# EAGLE design WNG_1_0 (EAGLE 7.6.0)
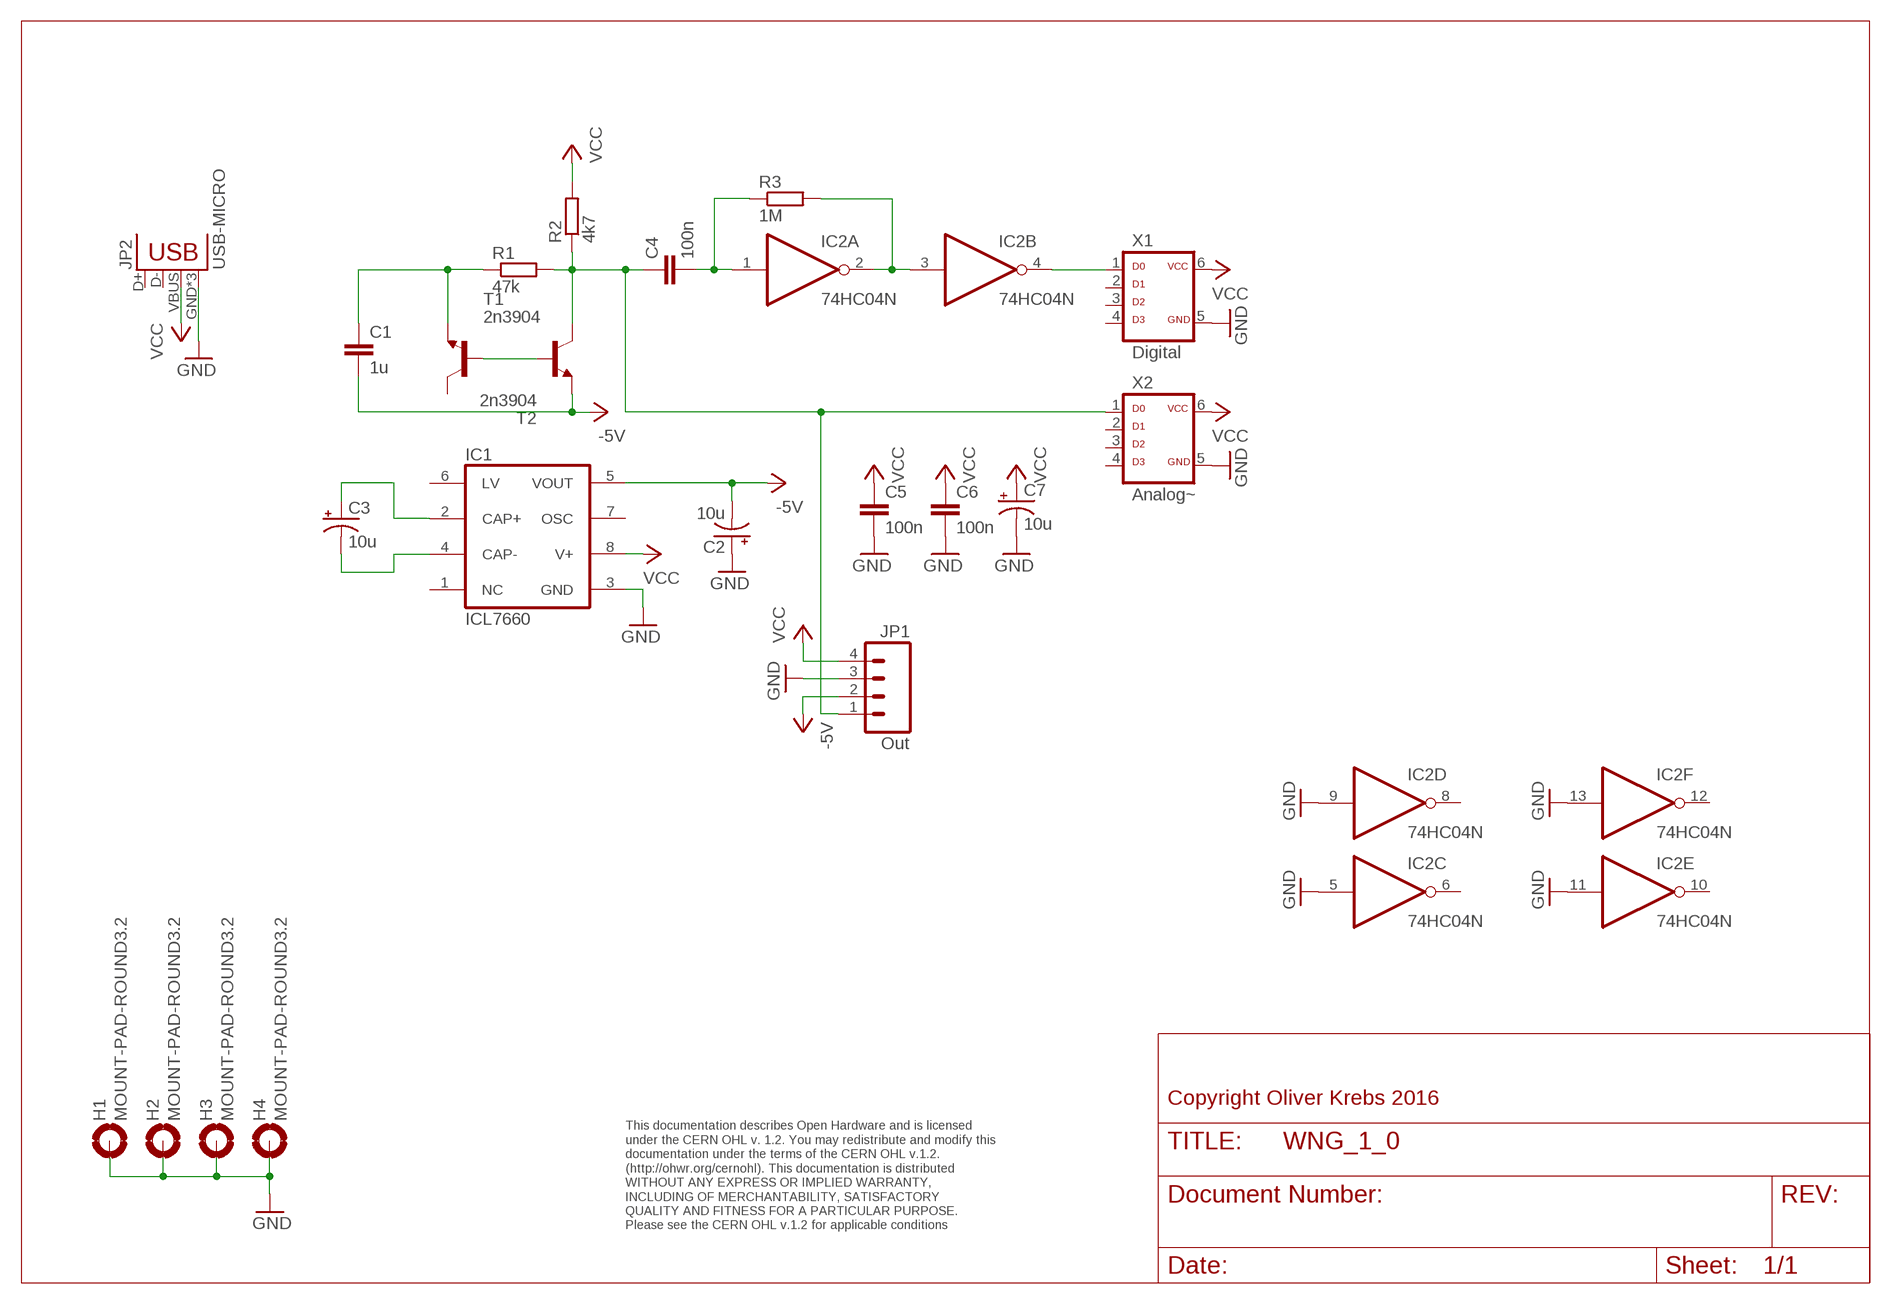
[diagram p0: schematic, sheet 1]

## Parts
C1  1u  CAPPTH1  [CAP-PTH-5MM]
C2  10u  CAP_POLPTH2  [CPOL-RADIAL-10UF-25V]
C3  10u  CAP_POLPTH2  [CPOL-RADIAL-10UF-25V]
C4  100n  CAPPTH1  [CAP-PTH-5MM]
C5  100n  CAPPTH1  [CAP-PTH-5MM]
C6  100n  CAPPTH1  [CAP-PTH-5MM]
C7  10u  CAP_POLPTH2  [CPOL-RADIAL-10UF-25V]
H1  MOUNT-PAD-ROUND3.2  [3,2-PAD]
H2  MOUNT-PAD-ROUND3.2  [3,2-PAD]
H3  MOUNT-PAD-ROUND3.2  [3,2-PAD]
H4  MOUNT-PAD-ROUND3.2  [3,2-PAD]
IC1  ICL7660  ICL7660CPA  [DIL08]
IC2  74HC04N  [DIL14]
JP1  Out  M04PTH  [1X04]
JP2  USB-MICRO  USB-MICROB2  [USB-MICROB2]
R1  47k  R-EU_0207/10  [0207/10]
R2  4k7  R-EU_0207/10  [0207/10]
R3  1M  R-EU_0207/10  [0207/10]
T1  2n3904  2N3904-NPN-TO92-EBC  [TO92-EBC]
T2  2n3904  2N3904-NPN-TO92-EBC  [TO92-EBC]
X1  Digital  ML6D  [ML-6]
X2  Analog~  ML6D  [ML-6]

## Nets
-5V: C1.2 C2.2(-) IC1.5(VOUT) JP1.2 T1.E
GND: C2.1(+) C5.2 C6.2 C7.2(-) H1.B3,2(MOUNT) H2.B3,2(MOUNT) H3.B3,2(MOUNT) H4.B3,2(MOUNT) IC1.3(GND) IC2.5(C:I) IC2.9(D:I) IC2.11(E:I) IC2.13(F:I) JP1.3 JP2.GND JP2.MT1(GND) JP2.MT2(GND) X1.5 X2.5
N$1: C1.1 R1.1 T2.E
N$2: C4.2 IC2.1(A:I) R3.1
N$3: C4.1 JP1.1 R1.2 R2.1 T1.C X2.1
N$4: T1.B T2.B
N$5: C3.1(+) IC1.2(CAP+)
N$6: C3.2(-) IC1.4(CAP-)
N$7: IC2.2(A:O) IC2.3(B:I) R3.2
N$11: IC2.4(B:O) X1.1
VCC: C5.1 C6.1 C7.1(+) IC1.8(V+) JP1.4 JP2.VBUS R2.2 X1.6 X2.6
Unconnected: IC1.1(NC) IC1.6(LV) IC1.7(OSC) IC2.6(C:O) IC2.8(D:O) IC2.10(E:O) IC2.12(F:O) JP2.D+ JP2.D- T2.C X1.2 X1.3 X1.4 X2.2 X2.3 X2.4

## Notes on the sheet
- Copyright Oliver Krebs 2016
- This documentation describes Open Hardware and is licensed 
  under the CERN OHL v. 1.2. You may redistribute and modify this 
  documentation under the terms of the CERN OHL v.1.2. 
  (http://ohwr.org/cernohl). This documentation is distributed
  WITHOUT ANY EXPRESS OR IMPLIED WARRANTY, 
  INCLUDING OF MERCHANTABILITY, SATISFACTORY 
  QUALITY AND FITNESS FOR A PARTICULAR PURPOSE. 
  Please see the CERN OHL v.1.2 for applicable conditions

## Power pins joined to a net without a drawn wire
GND: IC2.7(P:GND)
VCC: IC2.14(P:VCC)

## Library data of the parts
C1 C4-C6 = SparkFun-Passives:CAP: Capacitor Standard 0603 ceramic capacitor, and 0.1" leaded capacitor.
C2 C3 C7 = SparkFun-Passives:CAP_POL: Capacitor Polarized These are standard SMD and PTH capacitors. Normally 10uF, 47uF, and 100uF in electrolytic and tantalum varieties. Always verify the external diameter of the through hole cap, it varies with capacity, voltage, and manufacturer. The EIA devices should be standard.
H1-H4 = holes:MOUNT-PAD-ROUND: MOUNTING PAD, round
IC1 = maxim:ICL7660CPA: VOLTAGE CONVERTER; MF: INTERSIL; MPN: ICL7660CPA; OC_FARNELL: 1018170; OC_NEWARK: 06F7441
IC2 = 74xx-eu:74*04: Hex INVERTER
JP1 = SparkFun-Connectors:M04: Header 4 Standard 4-pin 0.1" header. Use with straight break away headers (SKU : PRT-00116), right angle break away headers (PRT-00553), swiss pins (PRT-00743), machine pins (PRT-00117), and female headers (PRT-00115). Molex polarized connector foot print use with SKU : PRT-08231 with associated crimp pins and housings. 1MM SMD Version SKU: PRT-10208
JP2 = SparkFun-Connectors:USB: USB Connectors USB-B-PTH is fully proven SKU : PRT-00139/CONN-08278 USB-miniB is fully proven SKU : PRT-00587 USB-A-PCB is untested. USB-A-H is throughly reviewed, but untested. Spark Fun Electronics SKU : PRT-00437 USB-B-SMT is throughly reviewed, but untested. Needs silkscreen touching up. USB-A-S has not been used/tested USB-MB-H has not been used/tested USB-MICROB has been used. CONN-09505
R1-R3 = 01-my_rcl:R-EU_: RESISTOR, European symbol
T1 T2 = transistor-neu-to92:*-NPN-: NPN Transistror
X1 X2 = 01-my-con:ML6D

## Board
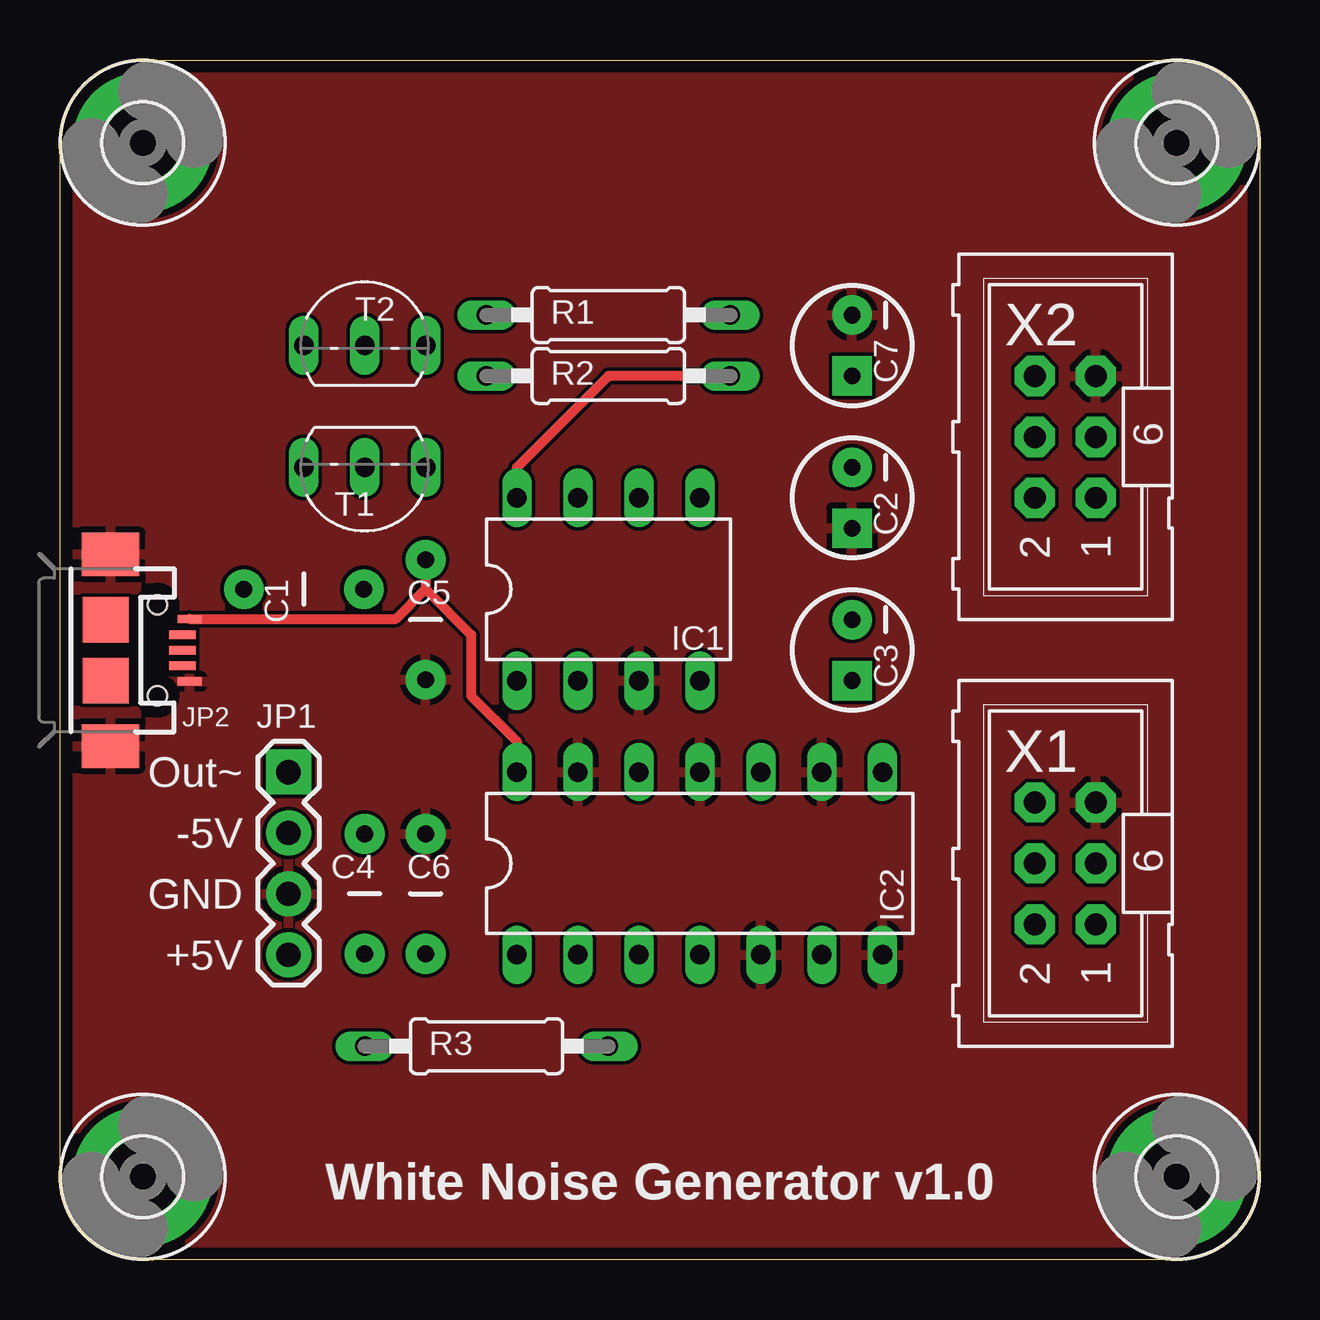
[diagram p1: board, top side]
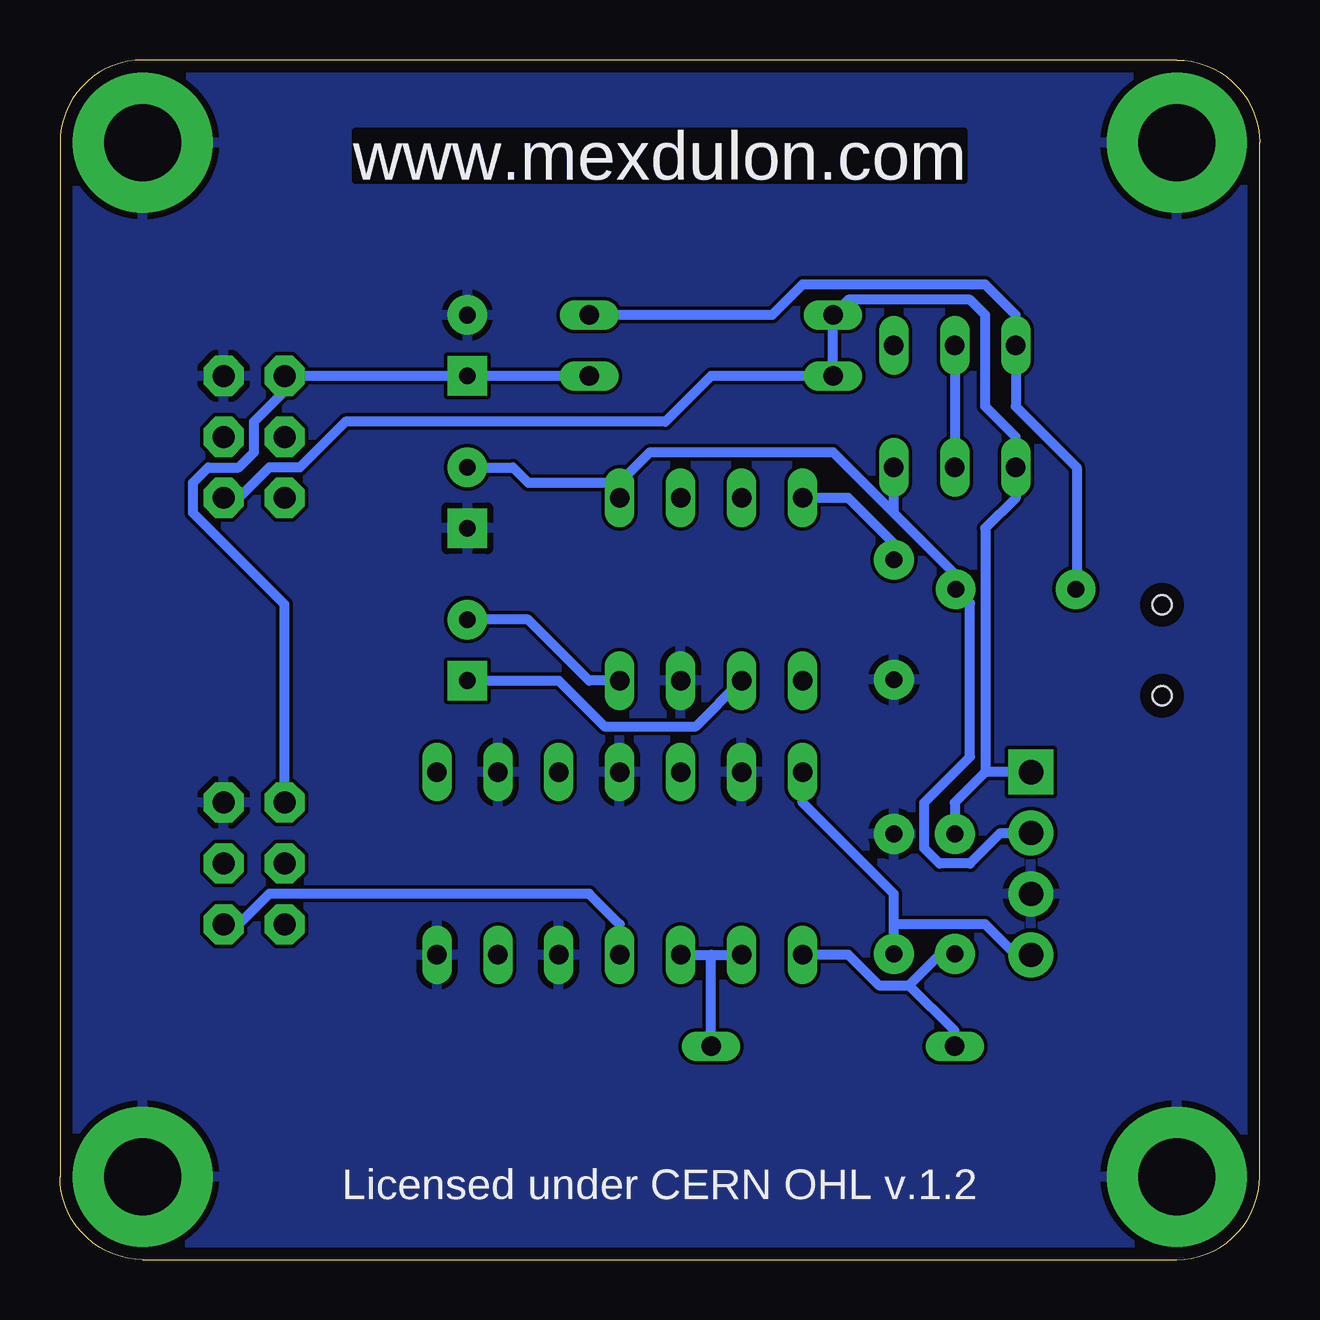
[diagram p2: board, bottom side, seen from below]

Size 50 x 50 mm. Coordinates in mm from the lower left corner, seen from the top.
Outline: 0,3.45 0,46.55 arc-90 3.45,50 46.55,50 arc-90 50,46.55 50,3.45 arc-90 46.55,0 3.45,0 arc-90 0,3.45
Copper layers (1*16): Top 0.035mm / dielectric 1.6mm / Bottom 0.035mm
Design rules "Elecrow_2-layer_PCB_eagle_rule": minimum track width 6mil, minimum drill 12mil, track to track 6mil, track to pad 6mil, pad to pad 6mil, via to via 8mil, smd to smd 0mil, copper to edge 20mil, drill to drill 10mil, minimum pad ring 6mil, minimum via ring 6mil, stop-mask expansion 0mil, vias tented up to drill 100mil, thermal gap 10mil

### Footprints (pad centres in the part's own frame; a part is rotated, then mirrored left to right if it is on the bottom)
CAP-PTH-5MM = drill 0.7 pad 1.651: 1 -2.5,0; 2 2.5,0
CPOL-RADIAL-10UF-25V = drill 0.7 pad 1.651 square: 1 1.27,0 | drill 0.7 pad 1.651: 2 -1.27,0
3,2-PAD = drill 3.2 pad 5.842: B3,2 0,0
DIL08 = drill 0.813 long: 1 -3.81,-3.81; 2 -1.27,-3.81; 3 1.27,-3.81; 4 3.81,-3.81; 5 3.81,3.81; 6 1.27,3.81; 7 -1.27,3.81; 8 -3.81,3.81
DIL14 = drill 0.813 long: 1 -7.62,-3.81; 2 -5.08,-3.81; 3 -2.54,-3.81; 4 0,-3.81; 5 2.54,-3.81; 6 5.08,-3.81; 7 7.62,-3.81; 8 7.62,3.81; 9 5.08,3.81; 10 2.54,3.81; 11 0,3.81; 12 -2.54,3.81; 13 -5.08,3.81; 14 -7.62,3.81
1X04 = drill 1.016 pad 1.88 square: 1 0,0 | drill 1.016 pad 1.88: 2 2.54,0; 3 5.08,0; 4 7.62,0
USB-MICROB2 = smd 0.35 x 1.1: D+ 0,3.2; D- -0.65,3.2; ID 0.65,3.2 | smd 0.35 x 1: GND 1.3,3.5; VBUS -1.3,3.5 | smd 1.8 x 2.4: MT1 -4,0.2; MT2 4,0.2 | smd 1.9 x 1.9: P$1 -1.27,0; P$2 1.27,0 | hole 0.8: -1.9,2.15; 1.9,2.15
0207/10 = drill 0.813 long: 1 -5.08,0; 2 5.08,0
TO92-EBC = drill 0.813 long: B 0,-1.27; C 2.54,-1.27; E -2.54,-1.27
ML-6 = drill 0.914 pad 1.676 octagon: 1 -2.54,-1.27; 2 -2.54,1.27; 3 0,-1.27; 4 0,1.27; 5 2.54,-1.27; 6 2.54,1.27

### Placement (x,y rotation side)
C1  10.16,27.94 0 top
C2  33.02,31.75 270 top
C3  33.02,25.4 270 top
C4  12.7,15.24 270 top
C5  15.24,26.67 270 top
C6  15.24,15.24 90 top
C7  33.02,38.1 270 top
H1  3.45,3.45 0 top
H2  3.45,46.55 0 top
H3  46.55,3.45 0 top
H4  46.55,46.55 0 top
IC1  22.86,27.94 0 top
IC2  26.67,16.51 0 top
JP1  9.53,20.32 270 top
JP2  1.91,25.4 270 top
R1  22.86,39.37 180 top
R2  22.86,36.83 0 top
R3  17.78,8.89 0 top
T1  12.7,31.75 180 top
T2  12.7,39.37 0 top
X1  41.91,16.51 90 top
X2  41.91,34.29 90 top

### Tracks (layer width: path | path; a pad name or v marks a point on that pad's centre or on a via)
-5V
  Bottom 0.406: 26.67,32.38 IC1.5 | 15.24,31.11 12.7,28.57 C1.2 12.06,27.34 12.06,20.95 13.97,19.05 13.97,17.14 13.34,16.51 12.06,16.51 10.79,17.78 JP1.2 | 15.24,31.11 T1.E | 15.24,31.11 17.78,33.66 25.4,33.66 26.67,32.38 | C2.2 31.11,33.02 30.48,32.38 26.67,32.38
GND
  pour Bottom: 0,0 50.8,0 50.8,50.8 0,50.8
  pour Top: 0,50.16 50.16,50.16 50.16,0 0,0
N$1
  Bottom 0.406: R1.1 20.32,39.37 19.05,40.64 11.43,40.64 10.16,39.37 T2.E 10.16,35.56 7.62,33.02 7.62,27.98 C1.1
N$2
  Bottom 0.406: 14.61,11.43 15.88,11.43 17.14,12.7 IC2.1 | 14.61,11.43 13.34,12.7 12.74,12.7 C4.2 | R3.1 12.7,9.53 14.61,11.43
N$3
  Bottom 0.406: 11.43,20.32 11.43,30.48 10.16,31.75 T1.C 10.16,34.29 11.43,35.56 11.43,39.37 12.06,40.01 17.14,40.01 R1.2 R2.1 22.86,36.83 24.77,34.92 38.1,34.92 40.01,33.02 41.27,33.02 42.55,31.75 X2.1 | 11.43,20.32 12.7,19.05 C4.1 | JP1.1 11.43,20.32
N$4
  Bottom 0.406: T2.B T1.B
N$5
  Bottom 0.406: C3.1 29.21,24.13 27.3,22.23 23.5,22.23 IC1.2
N$6
  Bottom 0.406: IC1.4 27.94,24.13 30.48,26.67 C3.2
N$7
  Bottom 0.406: IC2.3 22.86,12.7 | 22.86,12.7 IC2.2 | R3.2 22.86,12.7
N$11
  Bottom 0.406: X1.1 42.55,13.97 41.27,15.24 27.94,15.24 26.67,13.97 IC2.4
VCC
  Top 0.406: R2.2 22.86,36.83 19.05,33.02 IC1.8 | C5.1 15.24,27.94 | 15.24,27.94 17.14,26.04 17.14,23.5 19.05,21.59 IC2.14 | 15.24,27.94 14,26.7 JP2.VBUS
  Bottom 0.406: R2.2 C7.1 X2.6 40.64,36.2 41.91,34.92 41.91,33.66 42.55,33.02 43.81,33.02 44.45,32.38 44.45,31.11 40.64,27.3 X1.6 | C6.1 15.24,13.97 | 15.24,13.97 15.24,15.24 19.05,19.05 IC2.14 | 15.24,13.97 11.43,13.97 10.16,12.7 JP1.4 | C5.1 15.24,29.84 17.14,31.75 IC1.8

### Text on the board
Bottom: www.mexdulon.com
tNames: Out~ | -5V | GND | +5V | White Noise Generator v1.0
bNames: www.mexdulon.com | Licensed under CERN OHL v.1.2